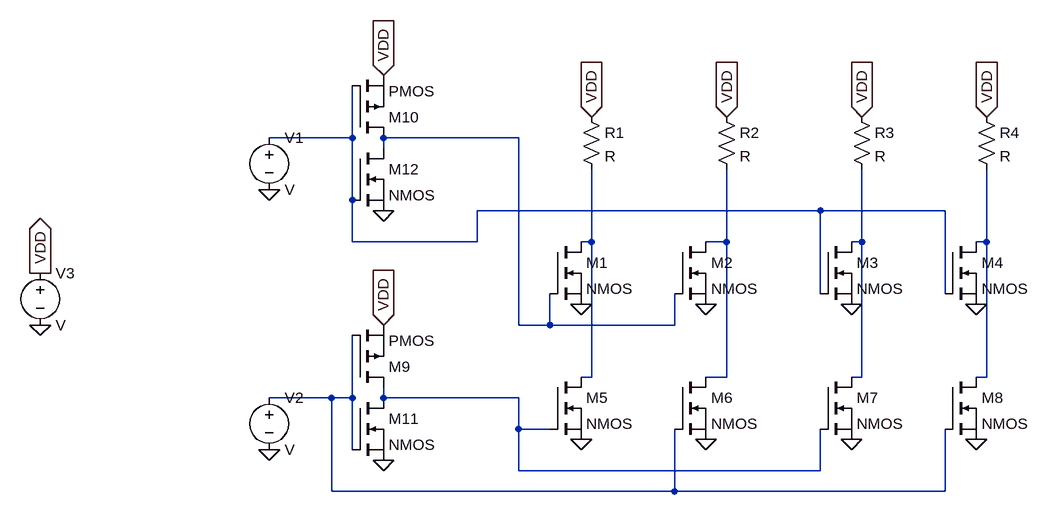
[diagram p0: schematic nordecoder4.asc]
nordecoder4.asc, the LTspice schematic file:
Version 4
SHEET 1 880 680
WIRE -208 -32 -208 -112
WIRE -208 -32 -336 -32
WIRE 48 -32 -160 -32
WIRE -160 -16 -160 -32
WIRE -208 64 -208 -32
WIRE 512 80 -16 80
WIRE 704 80 512 80
WIRE -208 128 -208 64
WIRE -16 128 -16 80
WIRE -16 128 -208 128
WIRE 160 128 160 16
WIRE 160 128 144 128
WIRE 368 128 368 16
WIRE 368 128 336 128
WIRE 576 128 576 16
WIRE 576 128 560 128
WIRE 768 128 768 16
WIRE 768 128 752 128
WIRE 512 208 512 80
WIRE 704 208 704 80
WIRE 48 256 48 -32
WIRE 96 256 96 208
WIRE 96 256 48 256
WIRE 288 256 288 208
WIRE 288 256 96 256
WIRE 160 336 160 128
WIRE 160 336 144 336
WIRE 368 336 368 128
WIRE 368 336 336 336
WIRE 576 336 576 128
WIRE 576 336 560 336
WIRE 768 336 768 128
WIRE 768 336 752 336
WIRE -240 368 -336 368
WIRE -208 368 -208 272
WIRE -208 368 -240 368
WIRE -160 368 -160 352
WIRE 48 368 -160 368
WIRE 48 416 48 368
WIRE 96 416 48 416
WIRE -208 448 -208 368
WIRE 48 480 48 416
WIRE 512 480 512 416
WIRE 512 480 48 480
WIRE -240 512 -240 368
WIRE 288 512 288 416
WIRE 288 512 -240 512
WIRE 704 512 704 416
WIRE 704 512 288 512
FLAG 144 224 0
FLAG 336 224 0
FLAG 560 224 0
FLAG 752 224 0
FLAG 752 432 0
FLAG 560 432 0
FLAG 336 432 0
FLAG 144 432 0
FLAG 160 -64 VDD
IOPIN 160 -64 In
FLAG 368 -64 VDD
IOPIN 368 -64 In
FLAG 576 -64 VDD
IOPIN 576 -64 In
FLAG 768 -64 VDD
IOPIN 768 -64 In
FLAG -160 256 VDD
IOPIN -160 256 In
FLAG -160 -128 VDD
IOPIN -160 -128 In
FLAG -160 464 0
FLAG -160 80 0
FLAG -688 176 VDD
IOPIN -688 176 Out
FLAG -336 48 0
FLAG -336 448 0
FLAG -688 256 0
SYMBOL nmos 96 128 R0
SYMATTR InstName M1
SYMBOL nmos 288 128 R0
SYMATTR InstName M2
SYMBOL res 144 -80 R0
SYMATTR InstName R1
SYMBOL res 352 -80 R0
SYMATTR InstName R2
SYMBOL res 560 -80 R0
SYMATTR InstName R3
SYMBOL res 752 -80 R0
SYMATTR InstName R4
SYMBOL nmos 512 128 R0
SYMATTR InstName M3
SYMBOL nmos 704 128 R0
SYMATTR InstName M4
SYMBOL nmos 96 336 R0
SYMATTR InstName M5
SYMBOL nmos 288 336 R0
SYMATTR InstName M6
SYMBOL nmos 512 336 R0
SYMATTR InstName M7
SYMBOL nmos 704 336 R0
SYMATTR InstName M8
SYMBOL pmos -208 352 M180
SYMATTR InstName M9
SYMBOL pmos -208 -32 M180
SYMATTR InstName M10
SYMBOL nmos -208 368 R0
SYMATTR InstName M11
SYMBOL nmos -208 -16 R0
SYMATTR InstName M12
SYMBOL voltage -336 -48 R0
SYMATTR InstName V1
SYMBOL voltage -336 352 R0
SYMATTR InstName V2
SYMBOL voltage -688 160 R0
SYMATTR InstName V3

The netlist it stands for:
* nordecoder4.asc
M1 N003 N002 0 0 NMOS
M2 N004 N002 0 0 NMOS
R1 VDD N003 R
R2 VDD N004 R
R3 VDD N005 R
R4 VDD N006 R
M3 N005 N001 0 0 NMOS
M4 N006 N001 0 0 NMOS
M5 N003 N008 0 0 NMOS
M6 N004 N007 0 0 NMOS
M7 N005 N008 0 0 NMOS
M8 N006 N007 0 0 NMOS
M9 N008 N007 VDD VDD PMOS
M10 N002 N001 VDD VDD PMOS
M11 N008 N007 0 0 NMOS
M12 N002 N001 0 0 NMOS
V1 N001 0 V
V2 N007 0 V
V3 VDD 0 V
.model NMOS NMOS
.model PMOS PMOS
.lib standard.mos
.backanno
.end